# Altium schematic sheet universal_flech.SchDoc
size A2
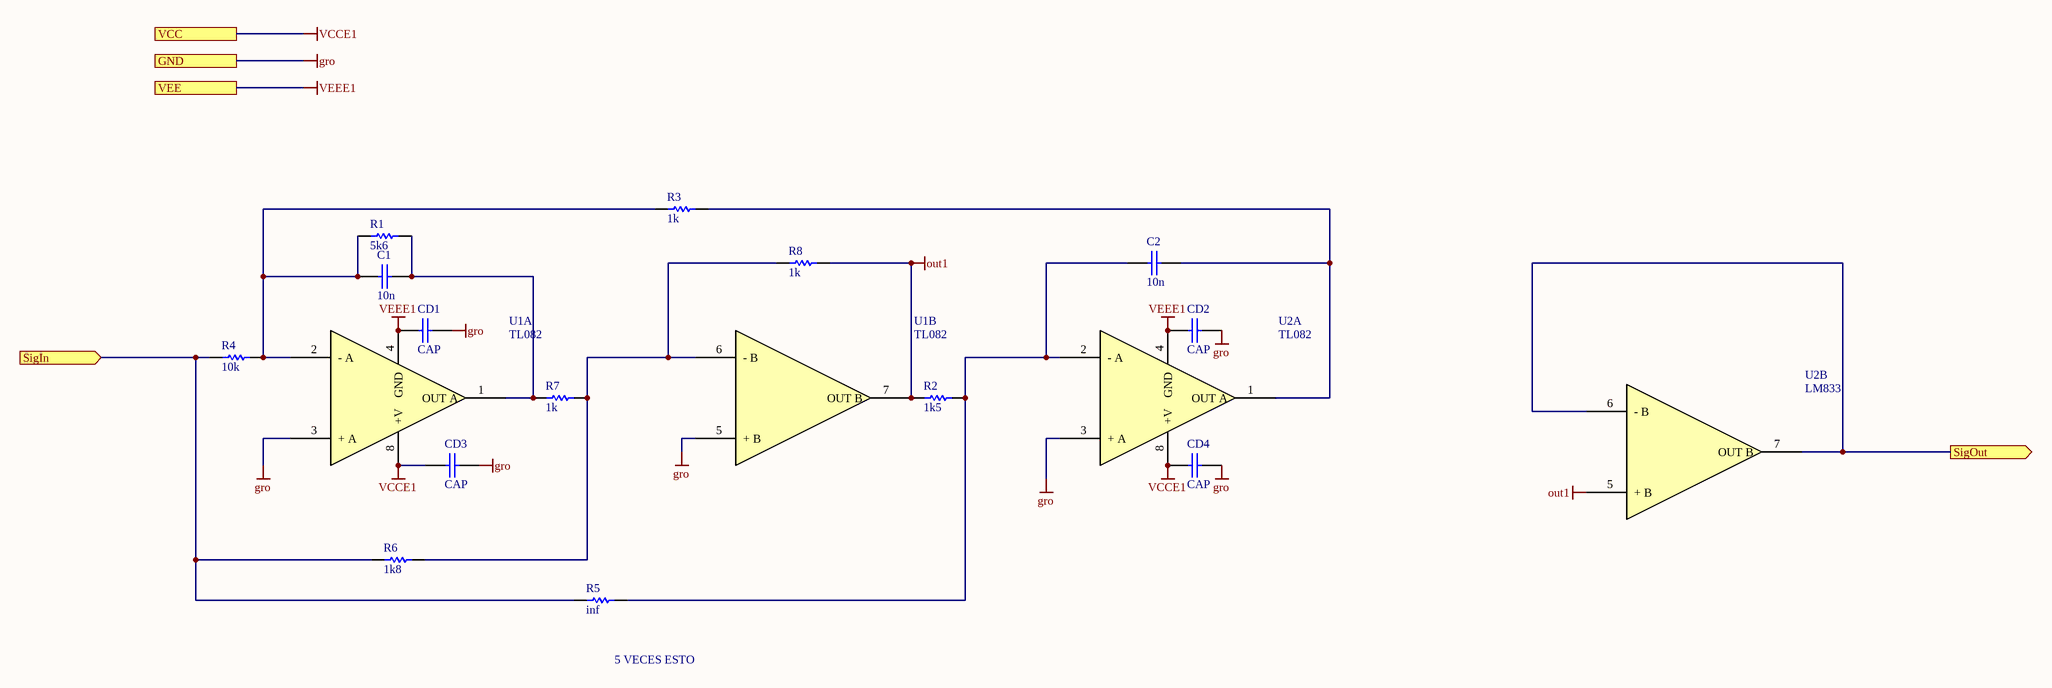
[diagram p0: universal_flech.SchDoc]

## Parts
C1  10n  [CAP200]
C2  10n  [CAP200]
CD1  CAP  [CAP200]
CD2  CAP  [CAP200]
CD3  CAP  [CAP200]
CD4  CAP  [CAP200]
R1  5k6  [0805]
R2  1k5  [0805]
R3  1k  [0805]
R4  10k  [0805]
R5  inf  [0805]
R6  1k8  [0805]
R7  1k  [0805]
R8  1k  [0805]
U1  TL082  [DIP8]  (parts A,B of 2)
U2  TL082  [DIP8]  (parts A,B of 2)

## Ports
GND, SigIn (in), SigOut (out), VCC, VEE

## Nets
gro: CD1.2 CD2.2 CD3.2 CD4.2 U1.3(+_A) U1.5(+_B) U2.3(+_A) ; port GND
out1: R2.1 R8.2 U1.7(OUT_B) U2.5(+_B)
VCCE1: CD3.1 CD4.1 U1.8(+V) U2.8(+V) ; port VCC
VEEE1: CD1.1 CD2.1 U1.4(GND) U2.4(GND) ; port VEE
SigIn: R4.1 R5.1 R6.1 ; port SigIn
SigOut: U2.6(-_B) U2.7(OUT_B) ; port SigOut
NetC1_1: C1.1 R1.1 R3.1 R4.2 U1.2(-_A)
NetC1_2: C1.2 R1.2 R7.1 U1.1(OUT_A)
NetC2_1: C2.1 R2.2 R5.2 U2.2(-_A)
NetC2_2: C2.2 R3.2 U2.1(OUT_A)
NetR6_2: R6.2 R7.2 R8.1 U1.6(-_B)

## Notes on the sheet
- 5 VECES ESTO

## Library data of the parts
C1 C2 = CAP
R1-R8 = RES
U1 U2 = LM833: Dual Audio Operational Amplifier